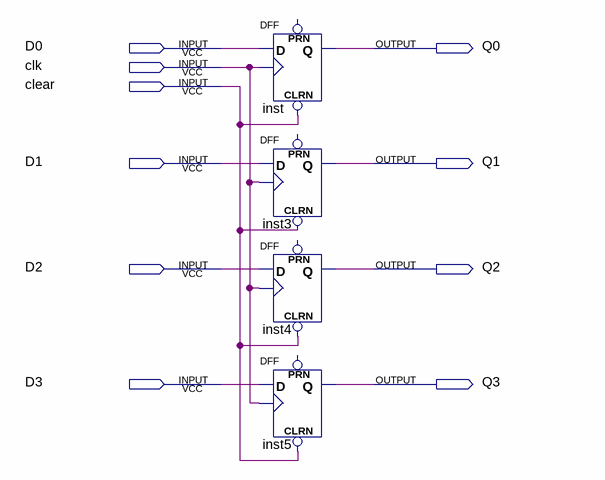
[diagram p0: schematic sheet]
// Quartus schematic jicun.bdf as structural Verilog: 4 symbols, 10 pins
module jicun (
  input  D0,
  input  clk,
  input  clear,
  input  D1,
  input  D2,
  input  D3,
  output Q0,
  output Q1,
  output Q2,
  output Q3
);

  DFF inst (.CLRN(clear), .CLK(clk), .D(D0), .Q(Q0));  // open: PRN
  DFF inst3 (.CLRN(clear), .CLK(clk), .D(D1), .Q(Q1));  // open: PRN
  DFF inst4 (.CLRN(clear), .CLK(clk), .D(D2), .Q(Q2));  // open: PRN
  DFF inst5 (.CLRN(clear), .CLK(clk), .D(D3), .Q(Q3));  // open: PRN
endmodule
